# EasyEDA schematic Ethernet_GPS.json
TITLE: Sheet_6; REV: 1.0; Date: 2022-01-31; Sheet: 1/1; Company: Your Company
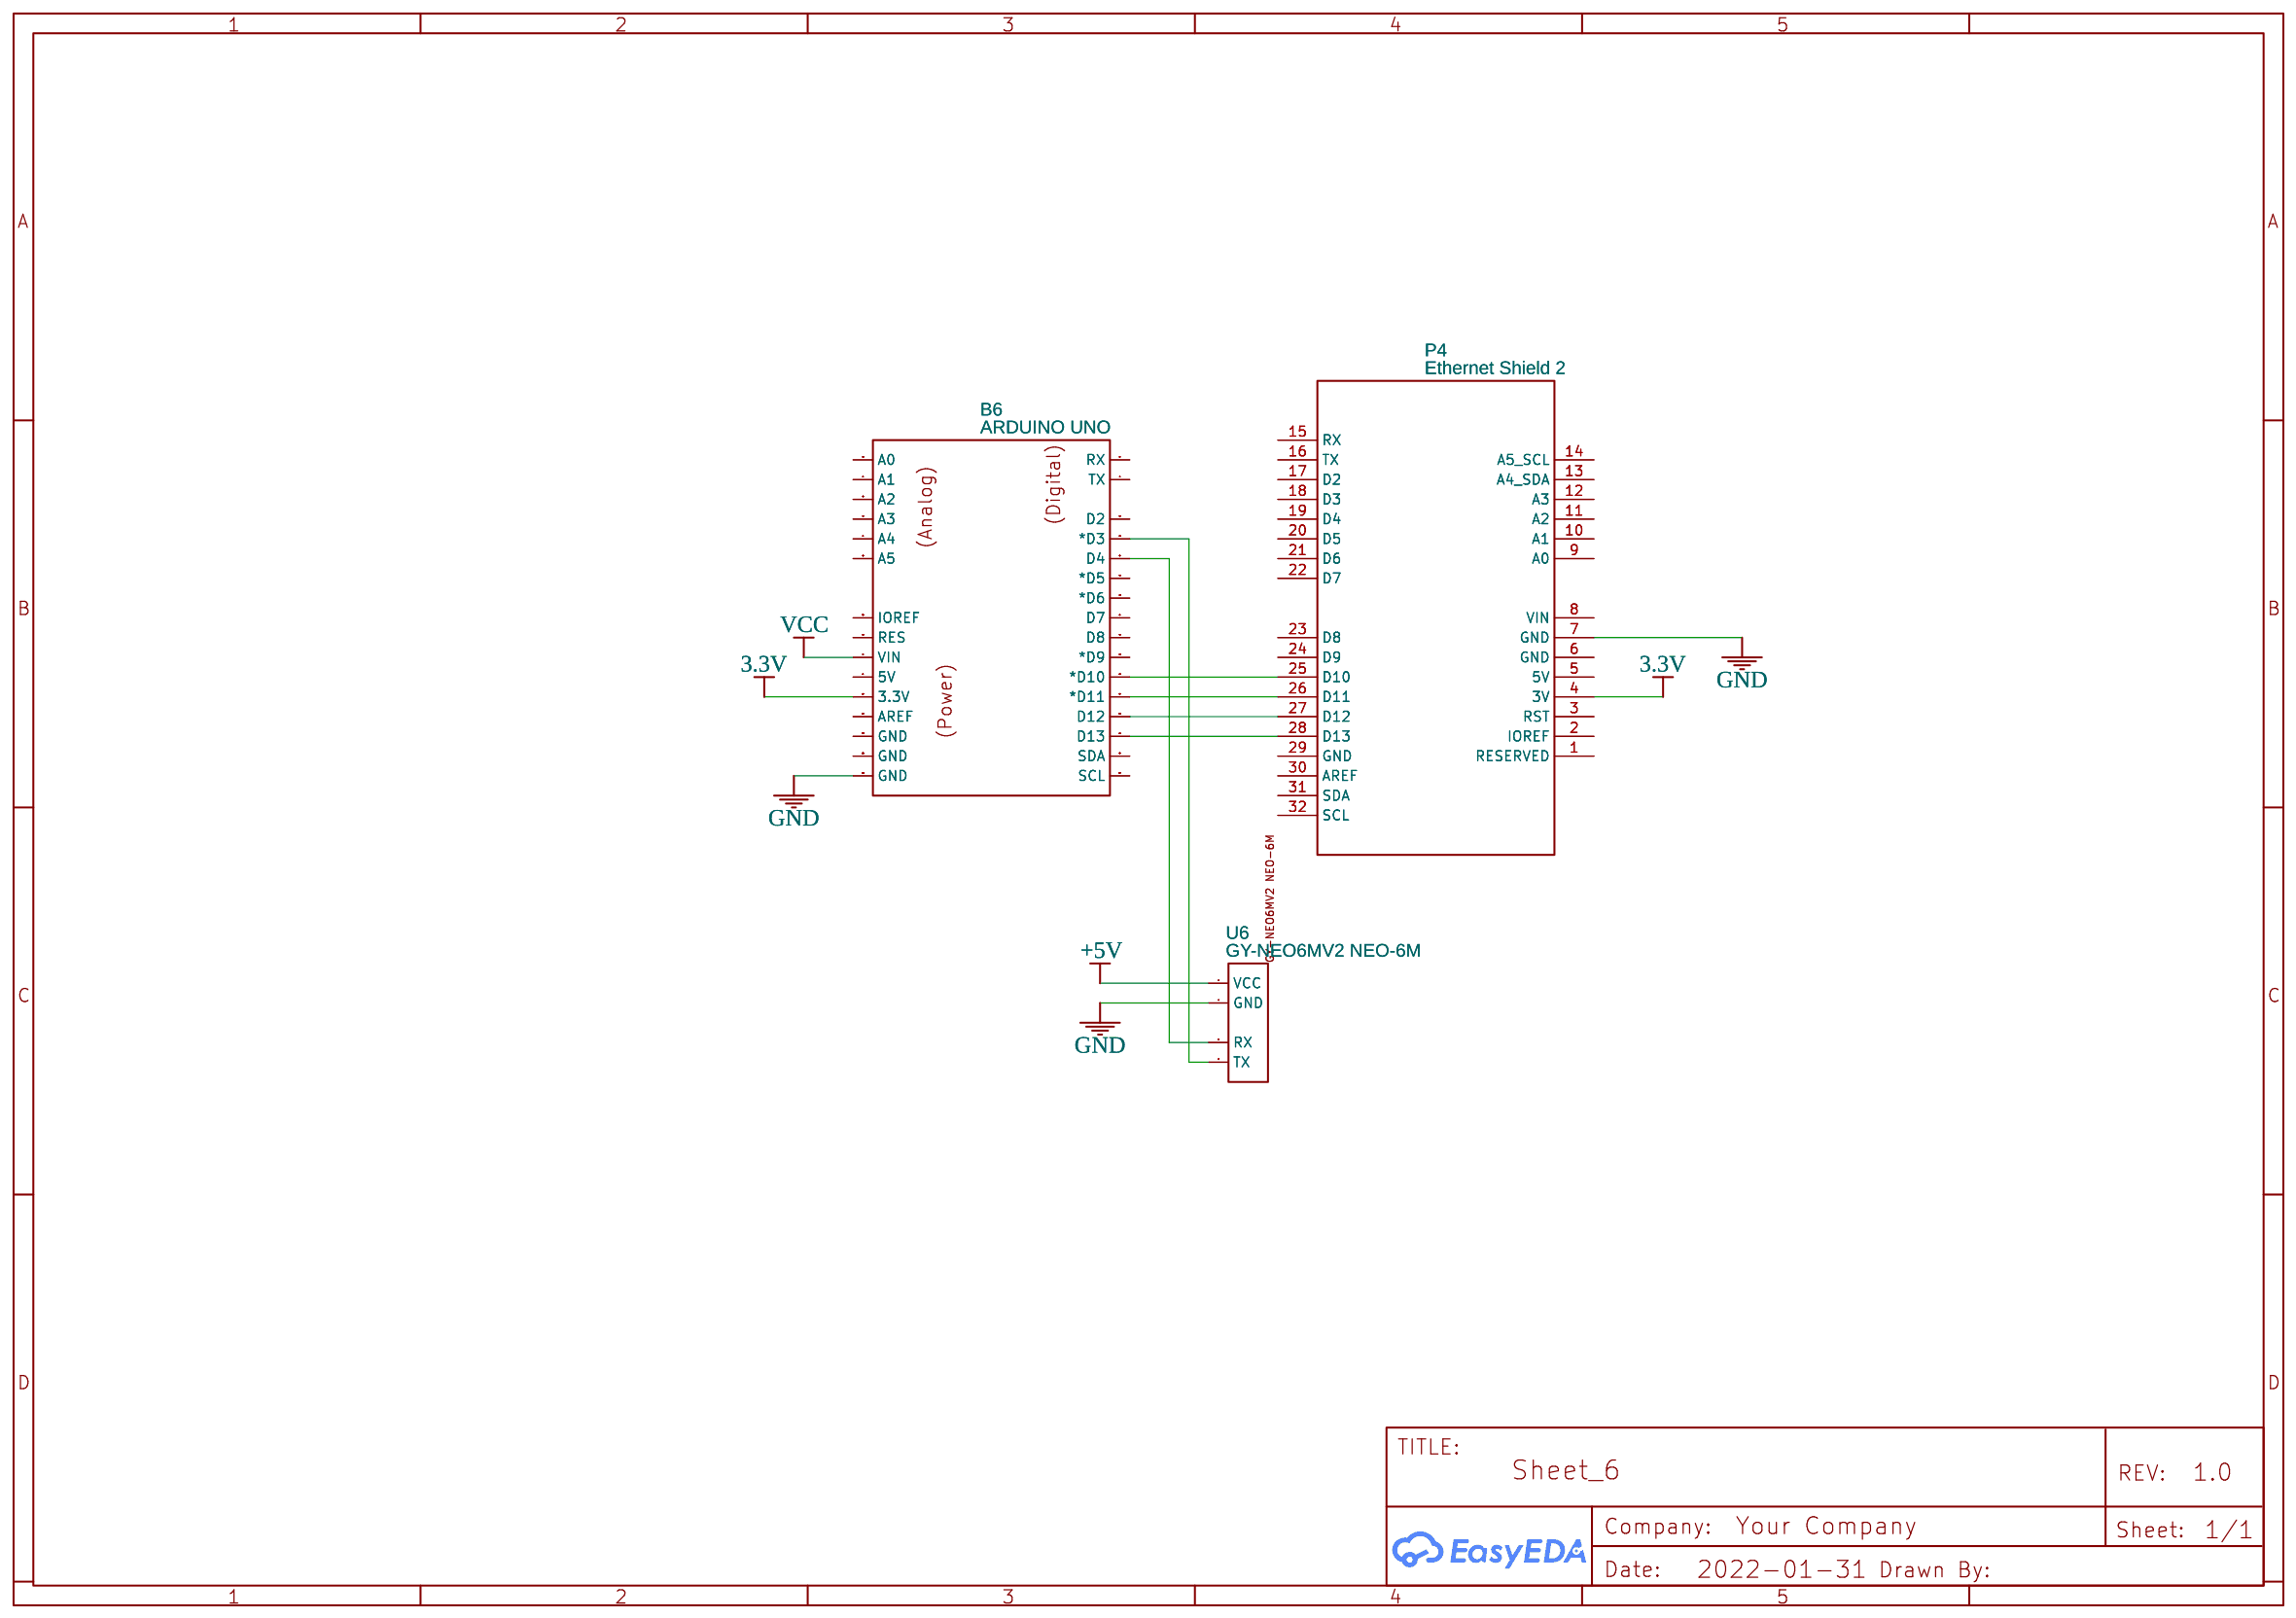
[diagram p0: schematic sheet]

## Parts
B6  ARDUINO UNO  [PKG-ARDUINO-UNO-R3-SHIELD]
P4  Ethernet Shield 2  [ETHERNET SHIELD 2]
U6  GY-NEO6MV2 NEO-6M  [GY-NEO6MV2 NEO-6M]

## Library data of the parts
B6 = ARDUINO UNO R3 SHIELD: Manufacturer: ?; Manufacturer Part: ?; Link: ?; Contributor: Prof. Ing. F. Scordino
P4 = Ethernet Shield 2: sourceId: 1T5FDZYC8; Contributor: Montre Med
U6 = GY-NEO6MV2 NEO-6M: Contributor: franco.fumanti

## Nets
3.3V: B6.3.3V P4.4(3V)
+5V: U6.4(VCC)
GND: B6.GND@0(GND) P4.7(GND) U6.1(GND)
VCC: B6.VIN
Net-(B6-D3): B6.D3(*D3) U6.2(TX)
Net-(B6-D4): B6.D4 U6.3(RX)
Net-(B6-D10): B6.D10(*D10) P4.25(D10)
Net-(B6-D11): B6.D11(*D11) P4.26(D11)
Net-(B6-D12): B6.D12 P4.27(D12)
Net-(B6-D13): B6.D13 P4.28(D13)

Not connected (* = marked no-connect by the designer): B6 5V A0 A1 A2 A3 A4 A5 AREF D2 D5(*D5) D6(*D6) D7 D8 D9(*D9) GND@1(GND) GND@2(GND) IOREF RES RX SCL SDA TX; P4 1(RESERVED) 2(IOREF) 3(RST) 5(5V) 6(GND) 8(VIN) 9(A0) 10(A1) 11(A2) 12(A3) 13(A4 SDA) 14(A5 SCL) 15(RX) 16(TX) 17(D2) 18(D3) 19(D4) 20(D5) 21(D6) 22(D7) 23(D8) 24(D9) 29(GND) 30(AREF) 31(SDA) 32(SCL)
